# Altium schematic sheet Sheet_2.schdoc
size 244 x 187 mm
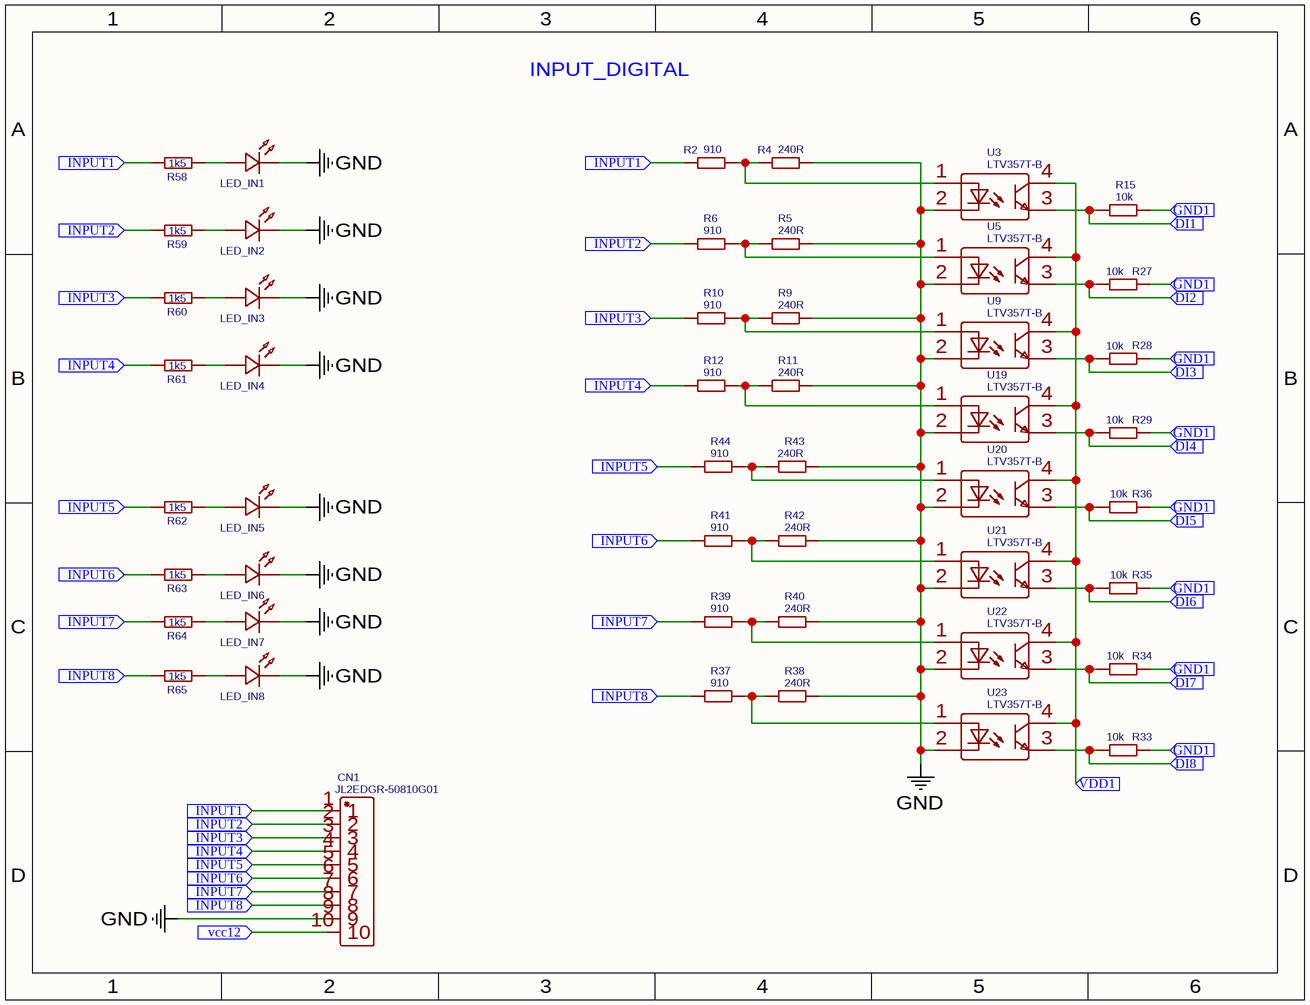
[diagram p0: Sheet_2.schdoc]

## Parts
CN1  JL2EDGR-50810G01  [CONN-TH_10P-P5.08_JL2EDGR]
LED_IN1  red  [LED1206-RD]  (value not drawn)
LED_IN2  red  [LED1206-RD]  (value not drawn)
LED_IN3  red  [LED1206-RD]  (value not drawn)
LED_IN4  red  [LED1206-RD]  (value not drawn)
LED_IN5  red  [LED1206-RD]  (value not drawn)
LED_IN6  red  [LED1206-RD]  (value not drawn)
LED_IN7  red  [LED1206-RD]  (value not drawn)
LED_IN8  red  [LED1206-RD]  (value not drawn)
R2  910  [R1206]
R4  240R  [R1206]
R5  240R  [R1206]
R6  910  [R1206]
R9  240R  [R1206]
R10  910  [R1206]
R11  240R  [R1206]
R12  910  [R1206]
R15  10k  [R1206]
R27  10k  [R1206]
R28  10k  [R1206]
R29  10k  [R1206]
R33  10k  [R1206]
R34  10k  [R1206]
R35  10k  [R1206]
R36  10k  [R1206]
R37  910  [R1206]
R38  240R  [R1206]
R39  910  [R1206]
R40  240R  [R1206]
R41  910  [R1206]
R42  240R  [R1206]
R43  240R  [R1206]
R44  910  [R1206]
R58  1k5  [R1206]
R59  1k5  [R1206]
R60  1k5  [R1206]
R61  1k5  [R1206]
R62  1k5  [R1206]
R63  1k5  [R1206]
R64  1k5  [R1206]
R65  1k5  [R1206]
U3  LTV357T-B  [SOP-4_L4.4-W4.0-P2.54-LS7.0-TL]
U5  LTV357T-B  [SOP-4_L4.4-W4.0-P2.54-LS7.0-TL]
U9  LTV357T-B  [SOP-4_L4.4-W4.0-P2.54-LS7.0-TL]
U19  LTV357T-B  [SOP-4_L4.4-W4.0-P2.54-LS7.0-TL]
U20  LTV357T-B  [SOP-4_L4.4-W4.0-P2.54-LS7.0-TL]
U21  LTV357T-B  [SOP-4_L4.4-W4.0-P2.54-LS7.0-TL]
U22  LTV357T-B  [SOP-4_L4.4-W4.0-P2.54-LS7.0-TL]
U23  LTV357T-B  [SOP-4_L4.4-W4.0-P2.54-LS7.0-TL]

## Ports
DI1 (in), DI2 (in), DI3 (in), DI4 (in), DI5 (in), DI6 (in), DI7 (in), DI8 (in), GND1 (in), INPUT1 (in), INPUT2 (in), INPUT3 (in), INPUT4 (in), INPUT5 (in), INPUT6 (in), INPUT7 (in), INPUT8 (in), vcc12 (in), VDD1 (in)

## Nets
GND: CN1.9 LED_IN1.2 LED_IN2.2 LED_IN3.2 LED_IN4.2 LED_IN5.2 LED_IN6.2 LED_IN7.2 LED_IN8.2 R4.1 R5.1 R9.1 R11.1 R38.1 R40.1 R42.1 R43.1 U3.2 U5.2 U9.2 U19.2 U20.2 U21.2 U22.2 U23.2
DI1: R15.2 U3.3 ; port DI1
DI2: R27.2 U5.3 ; port DI2
DI3: R28.2 U9.3 ; port DI3
DI4: R29.2 U19.3 ; port DI4
DI5: R36.2 U20.3 ; port DI5
DI6: R35.2 U21.3 ; port DI6
DI7: R34.2 U22.3 ; port DI7
DI8: R33.2 U23.3 ; port DI8
GND1: R15.1 R27.1 R28.1 R29.1 R33.1 R34.1 R35.1 R36.1 ; port GND1
INPUT1: CN1.1 R2.2 R58.2 ; port INPUT1
INPUT2: CN1.2 R6.2 R59.2 ; port INPUT2
INPUT3: CN1.3 R10.2 R60.2 ; port INPUT3
INPUT4: CN1.4 R12.2 R61.2 ; port INPUT4
INPUT5: CN1.5 R44.2 R62.2 ; port INPUT5
INPUT6: CN1.6 R41.2 R63.2 ; port INPUT6
INPUT7: CN1.7 R39.2 R64.2 ; port INPUT7
INPUT8: CN1.8 R37.2 R65.2 ; port INPUT8
vcc12: CN1.10 ; port vcc12
VDD1: U3.4 U5.4 U9.4 U19.4 U20.4 U21.4 U22.4 U23.4 ; port VDD1
NetLED_IN1_1: LED_IN1.1 R58.1
NetLED_IN2_1: LED_IN2.1 R59.1
NetLED_IN3_1: LED_IN3.1 R60.1
NetLED_IN4_1: LED_IN4.1 R61.1
NetLED_IN5_1: LED_IN5.1 R62.1
NetLED_IN6_1: LED_IN6.1 R63.1
NetLED_IN7_1: LED_IN7.1 R64.1
NetLED_IN8_1: LED_IN8.1 R65.1
NetR2_1: R2.1 R4.2 U3.1
NetR5_2: R5.2 R6.1 U5.1
NetR9_2: R9.2 R10.1 U9.1
NetR11_2: R11.2 R12.1 U19.1
NetR37_1: R37.1 R38.2 U23.1
NetR39_1: R39.1 R40.2 U22.1
NetR41_1: R41.1 R42.2 U21.1
NetR43_2: R43.2 R44.1 U20.1

## Notes on the sheet
- INPUT_DIGITAL

## Library data of the parts
CN1 = JL2EDGR-50810G01: BOM_Manufacturer: JILN; Contributor: LCSC; BOM_Supplier: LCSC; BOM_Supplier Part: C424394; BOM_Manufacturer Part: JL2EDGR-50810G01; BOM_JLCPCB Part Class: Extended Part; spicePre: C; spiceSymbolName: JL2EDGR-50810G01
LED_IN1-LED_IN8 = red: BOM_Manufacturer: HONGLITRONIC(Hongli Zhihui (HONGLITRONIC)); BOM_Manufacturer Part: HL-503H3GD; Contributor: LCSC; BOM_Supplier: LCSC; BOM_Supplier Part: C568941; spicePre: L; spiceSymbolName: HL-503H3GD
R2 R6 R10 R12 R37 R39 R41 R44 = 910: BOM_Manufacturer: Chian Chia Elec; nameAlias: Resistance (Ohms); Contributor: LCSC; BOM_Supplier: LCSC; BOM_Supplier Part: C120038; BOM_Manufacturer Part: -; BOM_JLCPCB Part Class: Extended Part; spicePre: R; spiceSymbolName: CF1/4W-200Ω±5% T52
R4 R5 R9 R11 R38 R40 R42 R43 = 240R: BOM_Manufacturer: Chian Chia Elec; nameAlias: Resistance (Ohms); Contributor: LCSC; BOM_Supplier: LCSC; BOM_Supplier Part: C120038; BOM_Manufacturer Part: -; BOM_JLCPCB Part Class: Extended Part; spicePre: R; spiceSymbolName: CF1/4W-200Ω±5% T52
R15 R27-R29 R33-R36 = 10k: BOM_Manufacturer: Chian Chia Elec; nameAlias: Resistance (Ohms); Contributor: LCSC; BOM_Supplier: LCSC; BOM_Supplier Part: C120038; BOM_Manufacturer Part: -; BOM_JLCPCB Part Class: Extended Part; spicePre: R; spiceSymbolName: CF1/4W-200Ω±5% T52
R58-R65 = 1k5: BOM_Manufacturer: Chian Chia Elec; nameAlias: Resistance (Ohms); Contributor: LCSC; BOM_Supplier: LCSC; BOM_Supplier Part: C120038; BOM_Manufacturer Part: -; BOM_JLCPCB Part Class: Extended Part; spicePre: R; spiceSymbolName: CF1/4W-200Ω±5% T52
U3 U5 U9 U19-U23 = LTV357T-B: BOM_Manufacturer: LITEON; Contributor: LCSC; BOM_Supplier: LCSC; BOM_Manufacturer Part: LTV357T-B; BOM_Supplier Part: C33068; BOM_JLCPCB Part Class: Extended Part; spicePre: U; spiceSymbolName: LTV357T-B